# EasyEDA schematic SCH_macropad_2024-06-17.json
TITLE: Sheet_1; REV: 1.0; Date: 2024-06-16; Sheet: 1/1; Drawn By: aeuddv; Company: Your Company
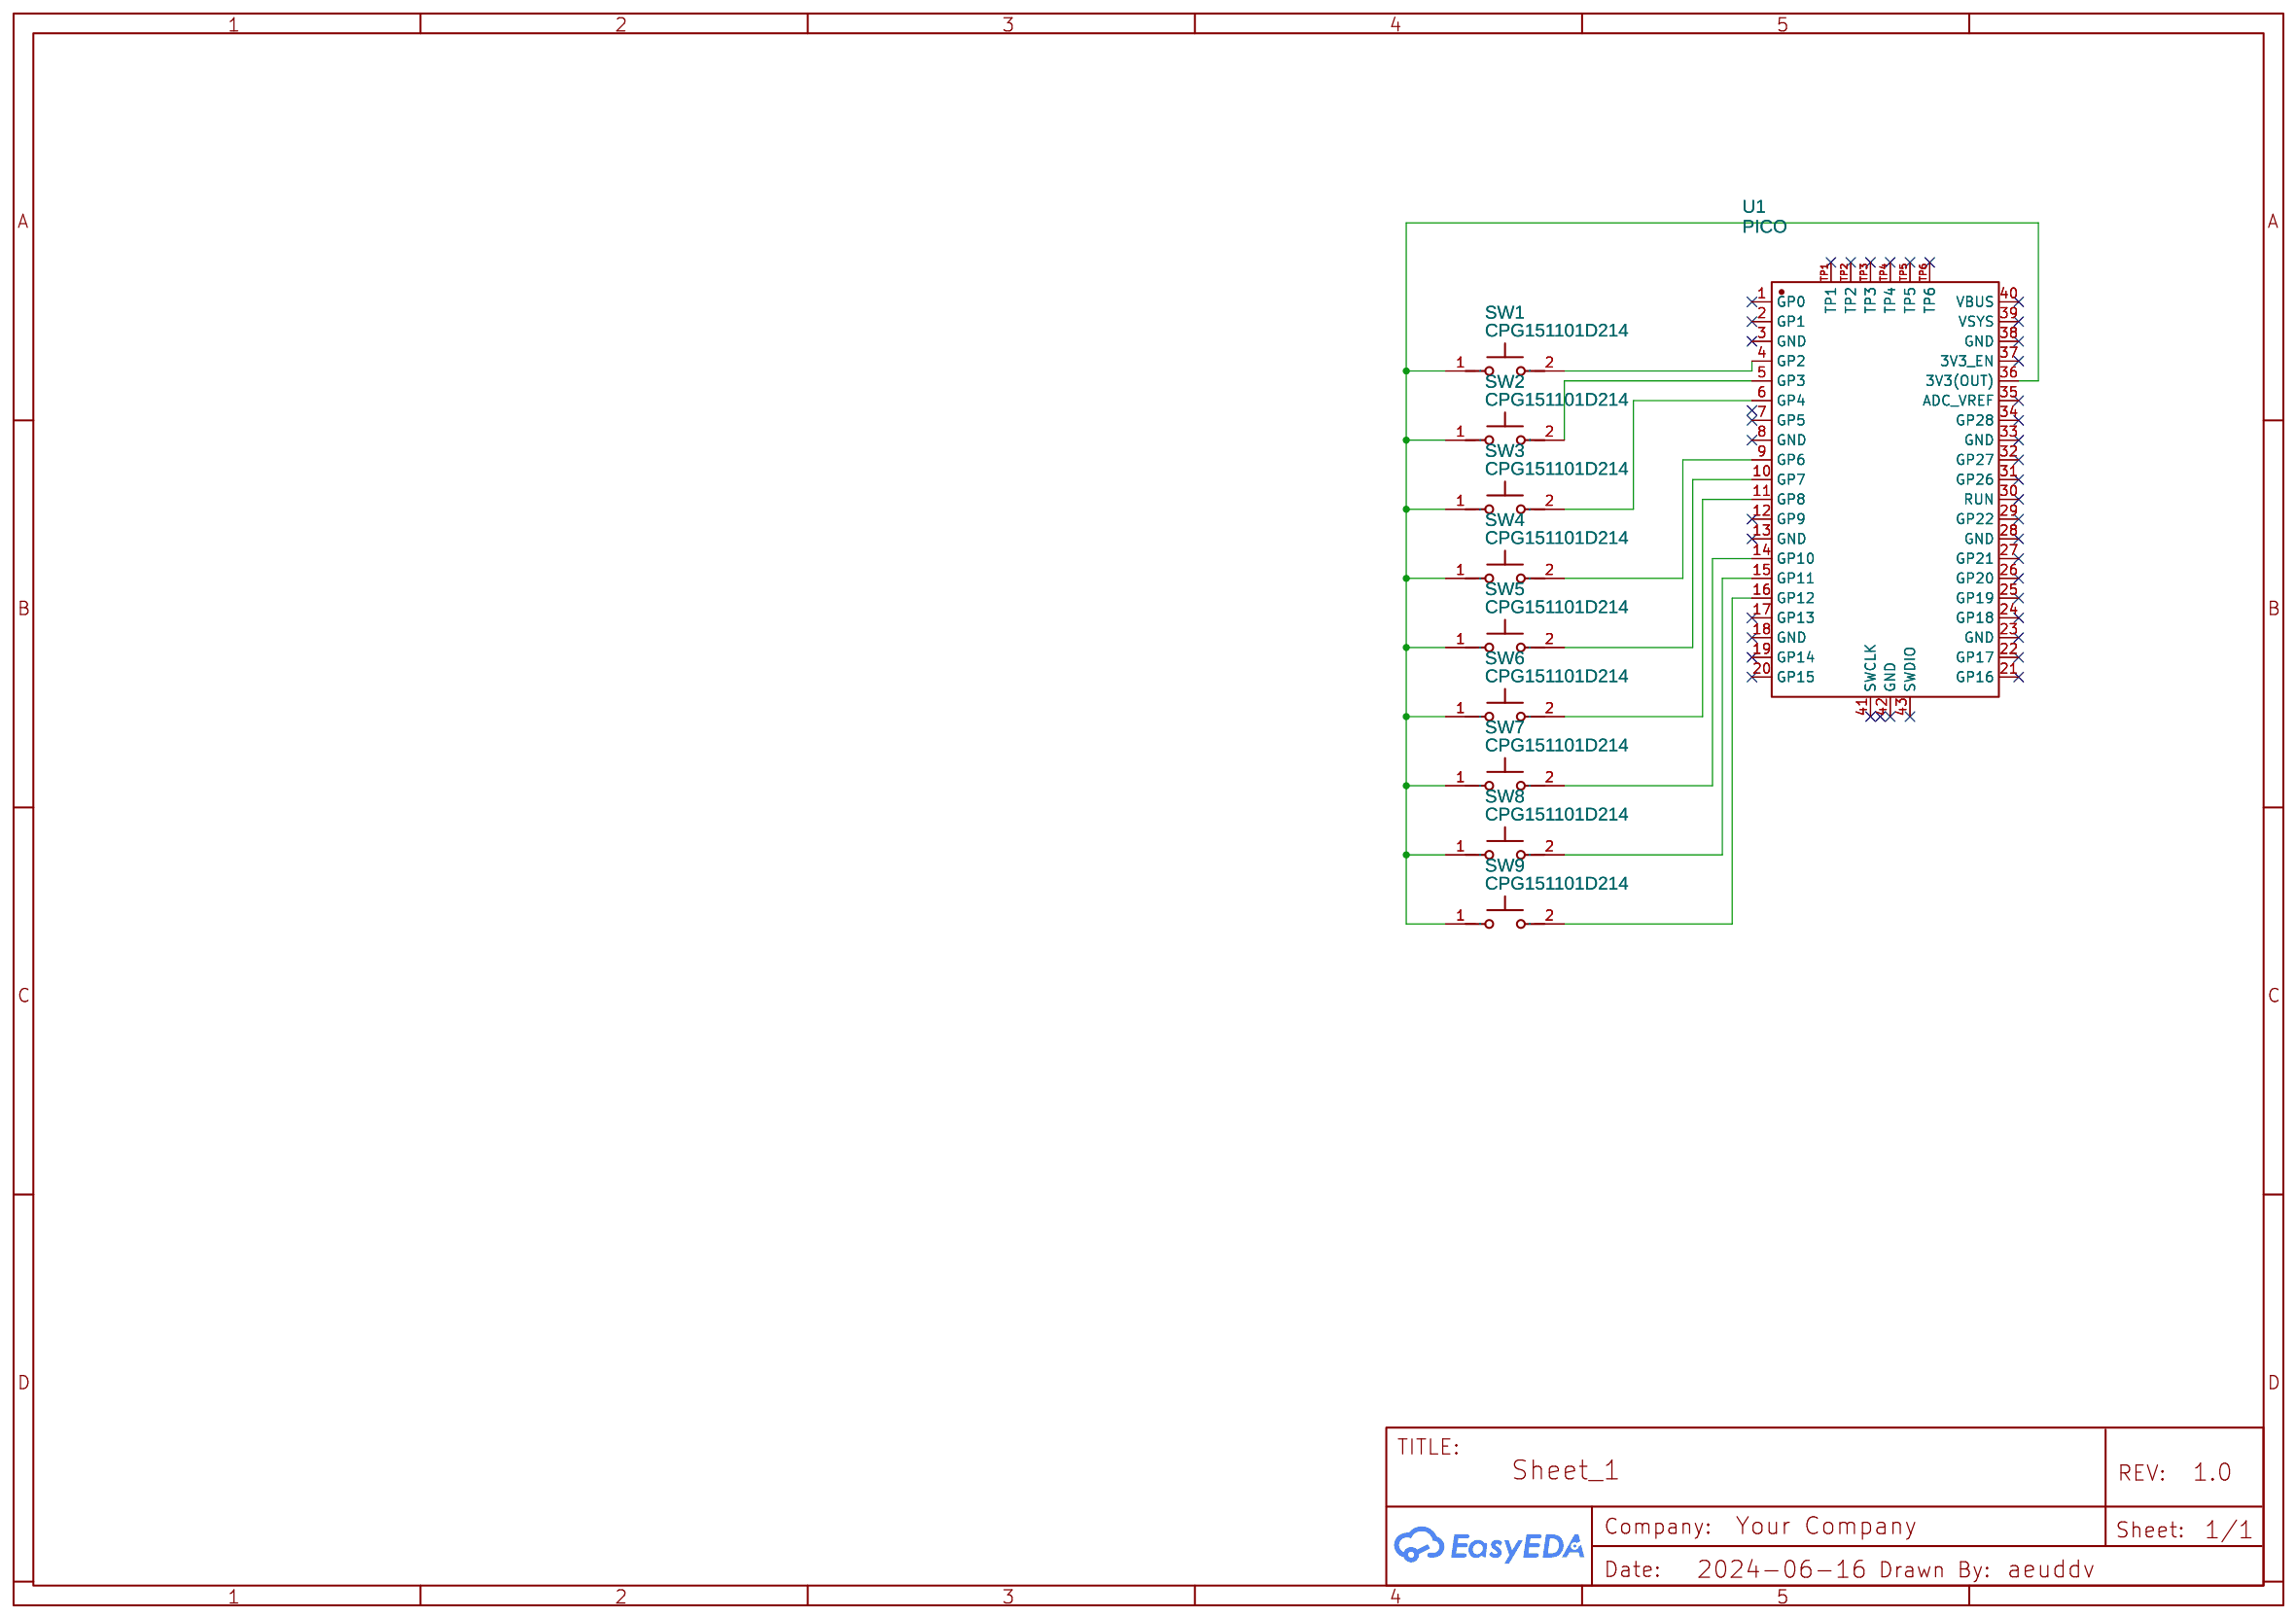
[diagram p0: schematic sheet]

## Parts
SW1  CPG151101D214  [KEY-TH_CPG151101D21X]
SW2  CPG151101D214  [KEY-TH_CPG151101D21X]
SW3  CPG151101D214  [KEY-TH_CPG151101D21X]
SW4  CPG151101D214  [KEY-TH_CPG151101D21X]
SW5  CPG151101D214  [KEY-TH_CPG151101D21X]
SW6  CPG151101D214  [KEY-TH_CPG151101D21X]
SW7  CPG151101D214  [KEY-TH_CPG151101D21X]
SW8  CPG151101D214  [KEY-TH_CPG151101D21X]
SW9  CPG151101D214  [KEY-TH_CPG151101D21X]
U1  PICO  [COMM-SMD_L51.0-W21.0-P2.54_SC0916]

## Library data of the parts
SW1-SW9 = CPG151101D214: Contributor: LCSC; Supplier: LCSC; Supplier Part: C400232; Manufacturer: Kailh(凯华); JLCPCB Part Class: Extended Part
U1 = PICO: Supplier: LCSC; Supplier Part: C7203002; Manufacturer: Raspberry Pi(树莓派); JLCPCB Part Class: Extended Part; Contributor: lcsc

## Nets
Net-(SW1-1): SW1.1 SW2.1 SW3.1 SW4.1 SW5.1 SW6.1 SW7.1 SW8.1 SW9.1 U1.36(3V3(OUT))
Net-(SW1-2): SW1.2 U1.4(GP2)
Net-(SW2-2): SW2.2 U1.5(GP3)
Net-(SW3-2): SW3.2 U1.6(GP4)
Net-(SW4-2): SW4.2 U1.9(GP6)
Net-(SW5-2): SW5.2 U1.10(GP7)
Net-(SW6-2): SW6.2 U1.11(GP8)
Net-(SW7-2): SW7.2 U1.14(GP10)
Net-(SW8-2): SW8.2 U1.15(GP11)
Net-(SW9-2): SW9.2 U1.16(GP12)

Not connected (* = marked no-connect by the designer): U1 1(GP0)* 2(GP1)* 3(GND)* 7(GP5)* 8(GND)* 12(GP9)* 13(GND)* 17(GP13)* 18(GND)* 19(GP14)* 20(GP15)* 21(GP16)* 22(GP17)* 23(GND)* 24(GP18)* 25(GP19)* 26(GP20)* 27(GP21)* 28(GND)* 29(GP22)* 30(RUN)* 31(GP26)* 32(GP27)* 33(GND)* 34(GP28)* 35(ADC_VREF)* 37(3V3_EN)* 38(GND)* 39(VSYS)* 40(VBUS)* 41(SWCLK)* 42(GND)* 43(SWDIO)* TP1* TP2* TP3* TP4* TP5* TP6*
